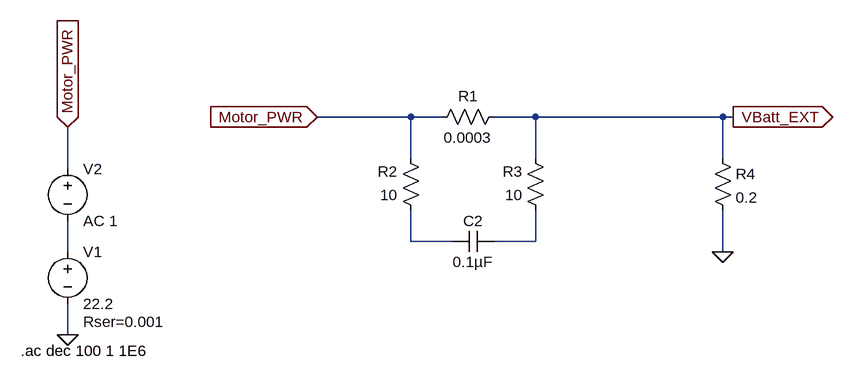
[diagram p0: schematic shunt_filter.asc]
shunt_filter.asc, the LTspice schematic file:
Version 4
SHEET 1 1424 680
WIRE -80 32 -224 32
WIRE -32 32 -80 32
WIRE 112 32 48 32
WIRE 400 32 112 32
WIRE 416 32 400 32
WIRE -80 96 -80 32
WIRE 112 96 112 32
WIRE 400 96 400 32
WIRE -608 112 -608 48
WIRE -80 224 -80 176
WIRE -16 224 -80 224
WIRE 112 224 112 176
WIRE 112 224 48 224
WIRE -608 240 -608 192
WIRE 400 240 400 176
WIRE -608 368 -608 320
FLAG -608 48 Motor_PWR
IOPIN -608 48 In
FLAG 400 240 0
FLAG 416 32 VBatt_EXT
IOPIN 416 32 Out
FLAG -608 368 0
FLAG -224 32 Motor_PWR
IOPIN -224 32 In
SYMBOL res 64 16 R90
WINDOW 0 0 56 VBottom 2
WINDOW 3 32 56 VTop 2
SYMATTR InstName R1
SYMATTR Value 0.0003
SYMBOL res -64 192 R180
WINDOW 0 36 76 Left 2
WINDOW 3 36 40 Left 2
SYMATTR InstName R2
SYMATTR Value 10
SYMBOL res 128 192 R180
WINDOW 0 36 76 Left 2
WINDOW 3 36 40 Left 2
SYMATTR InstName R3
SYMATTR Value 10
SYMBOL cap 48 208 R90
WINDOW 0 0 32 VBottom 2
WINDOW 3 32 32 VTop 2
SYMATTR InstName C2
SYMATTR Value 0.1µF
SYMBOL res 384 80 R0
SYMATTR InstName R4
SYMATTR Value 0.2
SYMATTR SpiceLine tol=1
SYMBOL voltage -608 224 R0
WINDOW 123 0 0 Left 0
WINDOW 39 24 124 Left 2
SYMATTR SpiceLine Rser=0.001
SYMATTR InstName V1
SYMATTR Value 22.2
SYMBOL voltage -608 96 R0
SYMATTR InstName V2
SYMATTR Value AC 1
TEXT -680 392 Left 2 !.ac dec 100 1 1E6

The netlist it stands for:
* shunt_filter.asc
R1 VBatt_EXT Motor_PWR 0.0003
R2 N001 Motor_PWR 10
R3 N002 VBatt_EXT 10
C2 N002 N001 0.1µF
R4 VBatt_EXT 0 0.2 tol=1
V1 N003 0 22.2 Rser=0.001
V2 Motor_PWR N003 AC 1
.ac dec 100 1 1E6
.backanno
.end